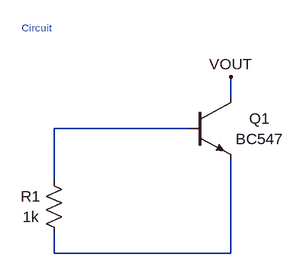
[diagram p0: schematic circuit.asc]
circuit.asc, the LTspice schematic file:
Version 4
SHEET 1 480 432
SYMBOL npn 448 336 R0
WINDOW 0 108 32 Center 2
WINDOW 3 108 64 Center 2
SYMATTR InstName Q1
SYMATTR Value BC547
SYMBOL res 256 560 R180
WINDOW 0 52 72 Center 2
WINDOW 3 52 40 Center 2
SYMATTR InstName R1
SYMATTR Value 1k
WIRE 240 384 240 464
WIRE 240 384 448 384
WIRE 240 544 240 576
WIRE 240 576 512 576
WIRE 512 304 512 336
WIRE 512 432 512 576
FLAG 512 304 VOUT
TEXT 190 228 Left 1 ;Circuit

The netlist it stands for:
* circuit.asc
Q1 VOUT N001 N002 0 BC547
R1 N002 N001 1k
.model NPN NPN
.model PNP PNP
.lib standard.bjt
* Circuit
.backanno
.end